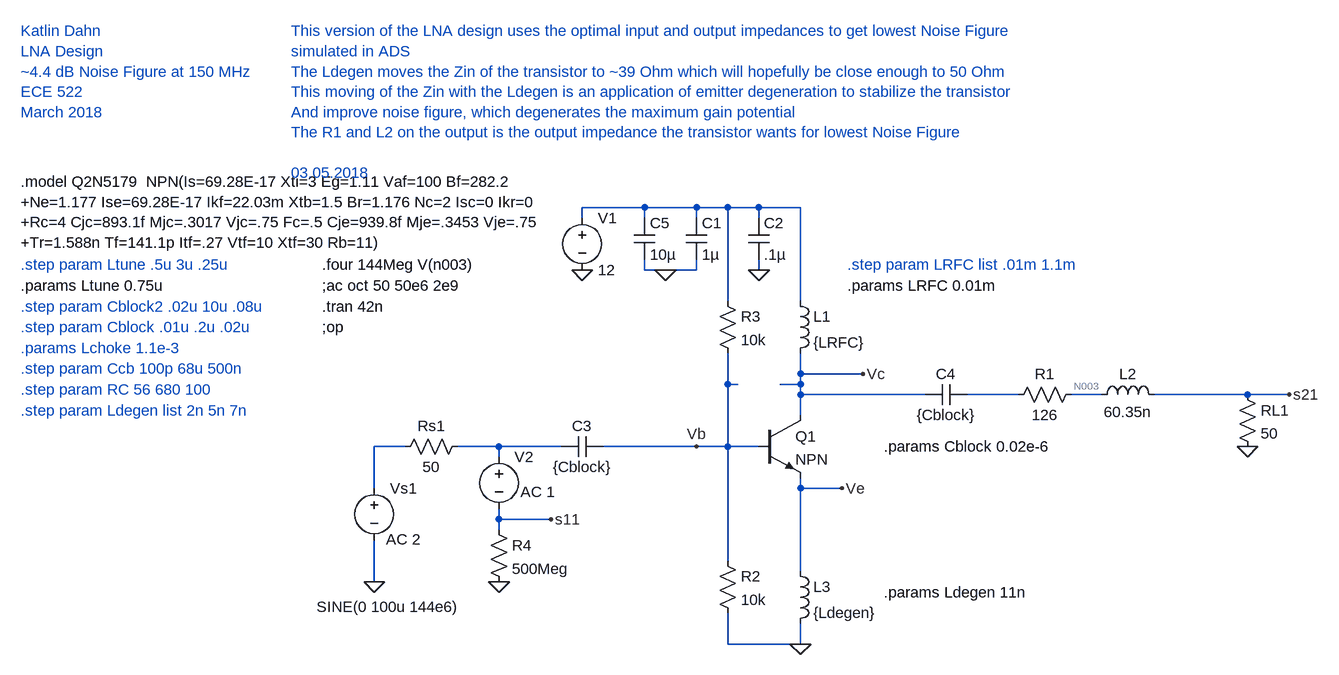
[diagram p0: schematic ECE_522_LNA_v5.asc]
ECE_522_LNA_v5.asc, the LTspice schematic file:
Version 4
SHEET 1 2012 788
WIRE 816 96 720 96
WIRE 896 96 816 96
WIRE 944 96 896 96
WIRE 992 96 944 96
WIRE 1056 96 992 96
WIRE 720 112 720 96
WIRE 816 112 816 96
WIRE 896 112 896 96
WIRE 992 112 992 96
WIRE 816 192 816 176
WIRE 848 192 816 192
WIRE 896 192 896 176
WIRE 896 192 848 192
WIRE 992 192 992 176
WIRE 944 240 944 96
WIRE 1056 240 1056 96
WIRE 1056 352 1056 320
WIRE 1152 352 1056 352
WIRE 944 368 944 320
WIRE 960 368 944 368
WIRE 1056 368 1056 352
WIRE 1056 368 1024 368
WIRE 1056 384 1056 368
WIRE 1248 384 1056 384
WIRE 1392 384 1312 384
WIRE 1520 384 1472 384
WIRE 1744 384 1600 384
WIRE 1808 384 1744 384
WIRE 1056 416 1056 384
WIRE 448 464 400 464
WIRE 592 464 528 464
WIRE 688 464 592 464
WIRE 896 464 752 464
WIRE 944 464 944 368
WIRE 944 464 896 464
WIRE 992 464 944 464
WIRE 592 480 592 464
WIRE 400 528 400 464
WIRE 1056 528 1056 512
WIRE 1120 528 1056 528
WIRE 592 576 592 560
WIRE 672 576 592 576
WIRE 592 592 592 576
WIRE 944 640 944 464
WIRE 1056 656 1056 528
WIRE 400 672 400 608
WIRE 944 768 944 720
WIRE 1056 768 1056 736
WIRE 1056 768 944 768
FLAG 720 192 0
FLAG 1056 768 0
FLAG 992 192 0
FLAG 400 672 0
FLAG 1744 464 0
FLAG 592 672 0
FLAG 672 576 s11
FLAG 1808 384 s21
FLAG 1152 352 Vc
FLAG 1120 528 Ve
FLAG 896 464 Vb
FLAG 848 192 0
SYMBOL voltage 720 96 R0
WINDOW 123 0 0 Left 2
WINDOW 39 0 0 Left 2
SYMATTR InstName V1
SYMATTR Value 12
SYMBOL npn 992 416 R0
SYMATTR InstName Q1
SYMBOL cap 976 112 R0
SYMATTR InstName C2
SYMATTR Value .1µ
SYMBOL res 928 624 R0
SYMATTR InstName R2
SYMATTR Value 10k
SYMBOL res 928 224 R0
SYMATTR InstName R3
SYMATTR Value 10k
SYMBOL cap 752 448 R90
WINDOW 0 0 32 VBottom 2
WINDOW 3 32 32 VTop 2
SYMATTR InstName C3
SYMATTR Value {Cblock}
SYMBOL cap 1312 368 R90
WINDOW 0 0 32 VBottom 2
WINDOW 3 32 32 VTop 2
SYMATTR InstName C4
SYMATTR Value {Cblock}
SYMBOL voltage 400 512 R0
WINDOW 3 -89 199 Left 2
WINDOW 123 18 95 Left 2
WINDOW 39 0 0 Left 2
SYMATTR Value SINE(0 100u 144e6)
SYMATTR Value2 AC 2
SYMATTR InstName Vs1
SYMBOL res 1728 368 R0
SYMATTR InstName RL1
SYMATTR Value 50
SYMBOL res 544 448 R90
WINDOW 0 0 56 VBottom 2
WINDOW 3 32 56 VTop 2
SYMATTR InstName Rs1
SYMATTR Value 50
SYMBOL voltage 592 464 R0
WINDOW 123 33 70 Left 2
WINDOW 39 0 0 Left 2
SYMATTR Value2 AC 1
SYMATTR InstName V2
SYMATTR Value ""
SYMBOL res 576 576 R0
SYMATTR InstName R4
SYMATTR Value 500Meg
SYMBOL ind 1040 224 R0
SYMATTR InstName L1
SYMATTR Value {LRFC}
SYMBOL ind 1040 640 R0
SYMATTR InstName L3
SYMATTR Value {Ldegen}
SYMBOL res 1488 368 R90
WINDOW 0 0 56 VBottom 2
WINDOW 3 32 56 VTop 2
SYMATTR InstName R1
SYMATTR Value 126
SYMBOL ind 1504 400 R270
WINDOW 0 32 56 VTop 2
WINDOW 3 5 56 VBottom 2
SYMATTR InstName L2
SYMATTR Value 60.35n
SYMBOL cap 880 112 R0
SYMATTR InstName C1
SYMATTR Value 1µ
SYMBOL cap 800 112 R0
SYMATTR InstName C5
SYMATTR Value 10µ
TEXT -144 56 Left 2 !.model Q2N5179  NPN(Is=69.28E-17 Xti=3 Eg=1.11 Vaf=100 Bf=282.2 \n+Ne=1.177 Ise=69.28E-17 Ikf=22.03m Xtb=1.5 Br=1.176 Nc=2 Isc=0 Ikr=0 \n+Rc=4 Cjc=893.1f Mjc=.3017 Vjc=.75 Fc=.5 Cje=939.8f Mje=.3453 Vje=.75 \n+Tr=1.588n Tf=141.1p Itf=.27 Vtf=10 Xtf=30 Rb=11)
TEXT 320 248 Left 2 !.tran 42n
TEXT 1184 464 Left 2 !.params Cblock 0.02e-6
TEXT 320 184 Left 2 !.four 144Meg V(n003)
TEXT 1128 184 Left 2 ;.step param LRFC list .01m 1.1m
TEXT 1128 216 Left 2 !.params LRFC 0.01m
TEXT 320 216 Left 2 !;ac oct 50 50e6 2e9
TEXT -144 376 Left 2 ;.step param RC 56 680 100
TEXT 320 280 Left 2 !;op
TEXT -144 344 Left 2 ;.step param Ccb 100p 68u 500n
TEXT -144 312 Left 2 ;.params Lchoke 1.1e-3
TEXT -144 280 Left 2 ;.step param Cblock .01u .2u .02u
TEXT -144 184 Left 2 ;.step param Ltune .5u 3u .25u
TEXT -144 216 Left 2 !.params Ltune 0.75u
TEXT -144 248 Left 2 ;.step param Cblock2 .02u 10u .08u
TEXT 272 -176 Left 2 ;This version of the LNA design uses the optimal input and output impedances to get lowest Noise Figure\nsimulated in ADS\nThe Ldegen moves the Zin of the transistor to ~39 Ohm which will hopefully be close enough to 50 Ohm\nThis moving of the Zin with the Ldegen is an application of emitter degeneration to stabilize the transistor\nAnd improve noise figure, which degenerates the maximum gain potential\nThe R1 and L2 on the output is the output impedance the transistor wants for lowest Noise Figure\n \n03.05.2018
TEXT -144 408 Left 2 ;.step param Ldegen list 2n 5n 7n
TEXT 1184 688 Left 2 !.params Ldegen 11n
TEXT -144 -176 Left 2 ;Katlin Dahn\nLNA Design\n~4.4 dB Noise Figure at 150 MHz\nECE 522\nMarch 2018

The netlist it stands for:
* ECE_522_LNA_v5.asc
V1 N001 0 12
Q1 Vc Vb Ve 0 NPN
C2 N001 0 .1µ
R2 Vb 0 10k
R3 N001 Vb 10k
C3 Vb N005 {Cblock}
C4 N002 Vc {Cblock}
Vs1 N004 0 SINE(0 100u 144e6) AC 2
RL1 s21 0 50
Rs1 N005 N004 50
V2 N005 s11 AC 1
R4 s11 0 500Meg
L1 N001 Vc {LRFC}
L3 Ve 0 {Ldegen}
R1 N003 N002 126
L2 N003 s21 60.35n
C1 N001 0 1µ
C5 N001 0 10µ
.model NPN NPN
.model PNP PNP
.lib standard.bjt
.model Q2N5179  NPN(Is=69.28E-17 Xti=3 Eg=1.11 Vaf=100 Bf=282.2
+Ne=1.177 Ise=69.28E-17 Ikf=22.03m Xtb=1.5 Br=1.176 Nc=2 Isc=0 Ikr=0
+Rc=4 Cjc=893.1f Mjc=.3017 Vjc=.75 Fc=.5 Cje=939.8f Mje=.3453 Vje=.75
+Tr=1.588n Tf=141.1p Itf=.27 Vtf=10 Xtf=30 Rb=11)
.tran 42n
.params Cblock 0.02e-6
.four 144Meg V(n003)
* .step param LRFC list .01m 1.1m
.params LRFC 0.01m
;ac oct 50 50e6 2e9
* .step param RC 56 680 100
;op
* .step param Ccb 100p 68u 500n
* .params Lchoke 1.1e-3
* .step param Cblock .01u .2u .02u
* .step param Ltune .5u 3u .25u
.params Ltune 0.75u
* .step param Cblock2 .02u 10u .08u
* This version of the LNA design uses the optimal input and output impedances to get lowest Noise Figure
* simulated in ADS
* The Ldegen moves the Zin of the transistor to ~39 Ohm which will hopefully be close enough to 50 Ohm
* This moving of the Zin with the Ldegen is an application of emitter degeneration to stabilize the transistor
* And improve noise figure, which degenerates the maximum gain potential
* The R1 and L2 on the output is the output impedance the transistor wants for lowest Noise Figure
* 03.05.2018
* .step param Ldegen list 2n 5n 7n
.params Ldegen 11n
* Katlin Dahn
* LNA Design
* ~4.4 dB Noise Figure at 150 MHz
* ECE 522
* March 2018
.backanno
.end